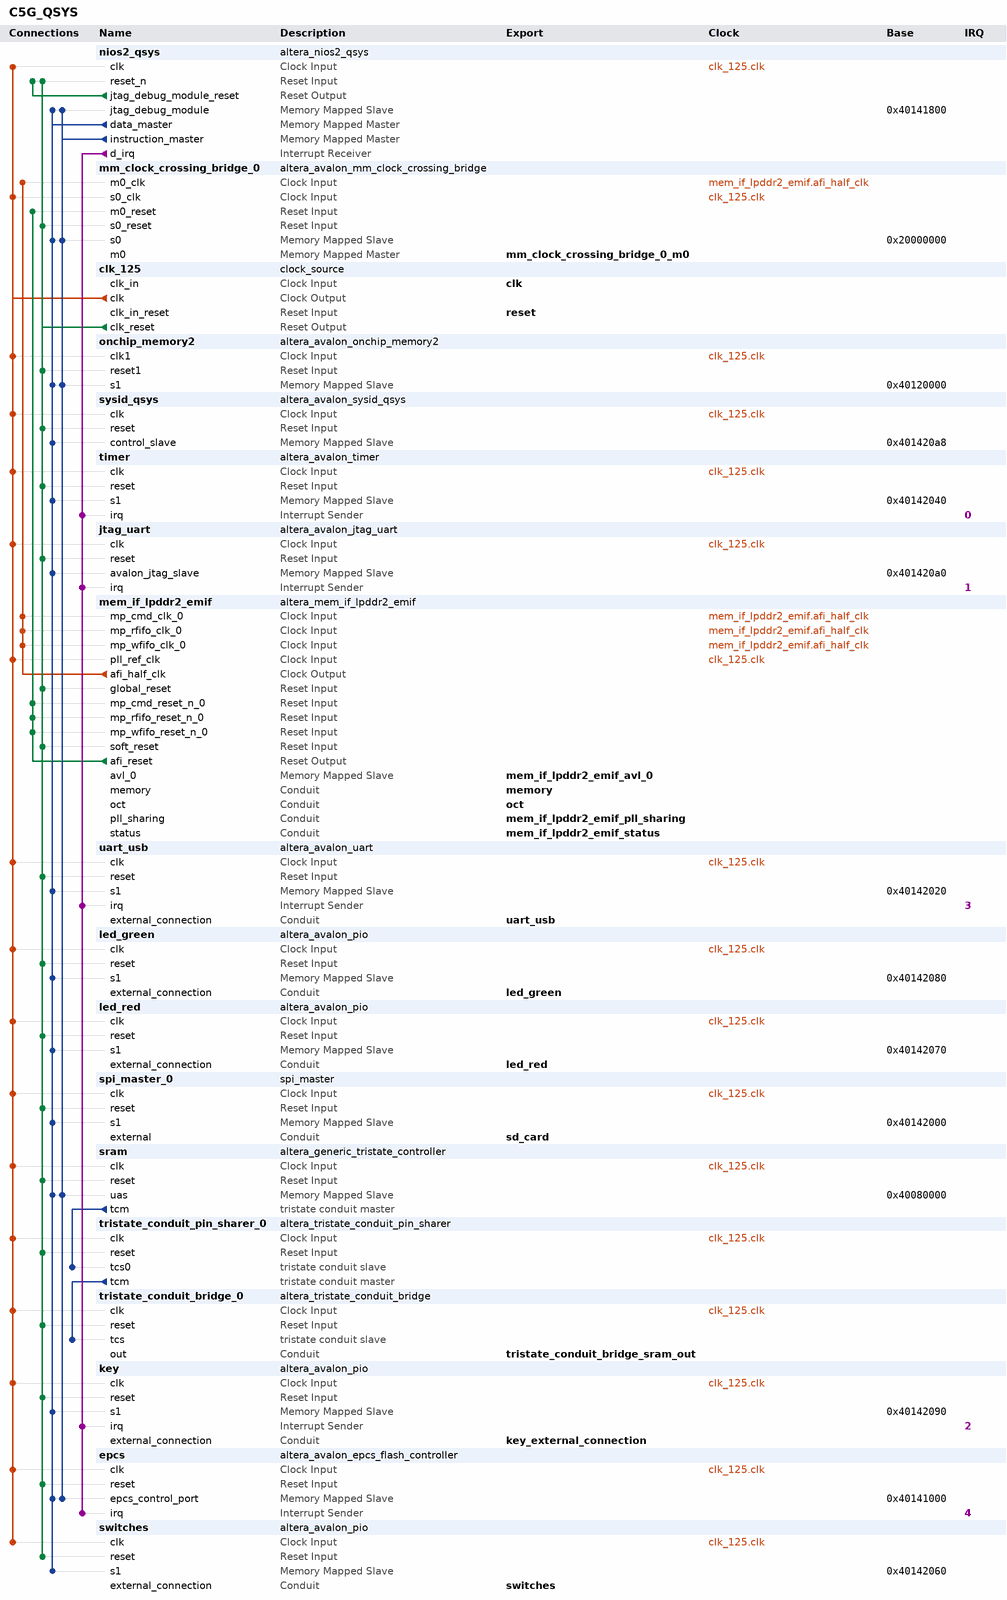
[diagram p0: system contents]
# Platform Designer (Qsys) system C5G_QSYS, Cyclone V 5CGXFC5C6F27C7
# Parameters at their usual value, and those the tool derives, are not listed.
package require -exact qsys 13.1
create_system C5G_QSYS
set_project_property DEVICE_FAMILY {Cyclone V}
set_project_property DEVICE 5CGXFC5C6F27C7

add_instance nios2_qsys altera_nios2_qsys 13.1
set_instance_parameter_value nios2_qsys muldiv_divider true
set_instance_parameter_value nios2_qsys resetSlave epcs.epcs_control_port
set_instance_parameter_value nios2_qsys mmu_TLBMissExcSlave None
set_instance_parameter_value nios2_qsys exceptionSlave sram.uas
set_instance_parameter_value nios2_qsys breakSlave nios2_qsys.jtag_debug_module
set_instance_parameter_value nios2_qsys impl Fast
set_instance_parameter_value nios2_qsys icache_size 4096

add_instance mm_clock_crossing_bridge_0 altera_avalon_mm_clock_crossing_bridge 13.1
set_instance_parameter_value mm_clock_crossing_bridge_0 DATA_WIDTH 32
set_instance_parameter_value mm_clock_crossing_bridge_0 ADDRESS_WIDTH 29
set_instance_parameter_value mm_clock_crossing_bridge_0 MAX_BURST_SIZE 8
set_instance_parameter_value mm_clock_crossing_bridge_0 COMMAND_FIFO_DEPTH 32
set_instance_parameter_value mm_clock_crossing_bridge_0 RESPONSE_FIFO_DEPTH 32
set_instance_parameter_value mm_clock_crossing_bridge_0 MASTER_SYNC_DEPTH 2
set_instance_parameter_value mm_clock_crossing_bridge_0 SLAVE_SYNC_DEPTH 2

add_instance clk_125 clock_source 13.1
set_instance_parameter_value clk_125 clockFrequency 125000000

add_instance onchip_memory2 altera_avalon_onchip_memory2 13.1
set_instance_parameter_value onchip_memory2 dataWidth 32
set_instance_parameter_value onchip_memory2 dualPort false
set_instance_parameter_value onchip_memory2 initMemContent true
set_instance_parameter_value onchip_memory2 initializationFileName onchip_mem.hex
set_instance_parameter_value onchip_memory2 memorySize 128000

add_instance sysid_qsys altera_avalon_sysid_qsys 13.1
set_instance_parameter_value sysid_qsys id 0

add_instance timer altera_avalon_timer 13.1
set_instance_parameter_value timer period 1
set_instance_parameter_value timer periodUnits MSEC

add_instance jtag_uart altera_avalon_jtag_uart 13.1
set_instance_parameter_value jtag_uart simInteractiveOptions NO_INTERACTIVE_WINDOWS

add_instance mem_if_lpddr2_emif altera_mem_if_lpddr2_emif 13.1
set_instance_parameter_value mem_if_lpddr2_emif MEM_VENDOR Micron
set_instance_parameter_value mem_if_lpddr2_emif MEM_FORMAT DISCRETE
set_instance_parameter_value mem_if_lpddr2_emif DISCRETE_FLY_BY true
set_instance_parameter_value mem_if_lpddr2_emif DEVICE_DEPTH 1
set_instance_parameter_value mem_if_lpddr2_emif MEM_MIRROR_ADDRESSING 0
set_instance_parameter_value mem_if_lpddr2_emif MEM_CLK_FREQ_MAX 400.0
set_instance_parameter_value mem_if_lpddr2_emif MEM_ROW_ADDR_WIDTH 14
set_instance_parameter_value mem_if_lpddr2_emif MEM_COL_ADDR_WIDTH 10
set_instance_parameter_value mem_if_lpddr2_emif MEM_DQ_WIDTH 32
set_instance_parameter_value mem_if_lpddr2_emif MEM_DQ_PER_DQS 8
set_instance_parameter_value mem_if_lpddr2_emif MEM_BANKADDR_WIDTH 3
set_instance_parameter_value mem_if_lpddr2_emif MEM_IF_DM_PINS_EN true
set_instance_parameter_value mem_if_lpddr2_emif MEM_IF_DQSN_EN true
set_instance_parameter_value mem_if_lpddr2_emif MEM_NUMBER_OF_DIMMS 1
set_instance_parameter_value mem_if_lpddr2_emif MEM_NUMBER_OF_RANKS_PER_DIMM 1
set_instance_parameter_value mem_if_lpddr2_emif MEM_NUMBER_OF_RANKS_PER_DEVICE 1
set_instance_parameter_value mem_if_lpddr2_emif MEM_RANK_MULTIPLICATION_FACTOR 1
set_instance_parameter_value mem_if_lpddr2_emif MEM_CK_WIDTH 1
set_instance_parameter_value mem_if_lpddr2_emif MEM_CS_WIDTH 1
set_instance_parameter_value mem_if_lpddr2_emif MEM_CLK_EN_WIDTH 1
set_instance_parameter_value mem_if_lpddr2_emif ALTMEMPHY_COMPATIBLE_MODE false
set_instance_parameter_value mem_if_lpddr2_emif NEXTGEN true
set_instance_parameter_value mem_if_lpddr2_emif MEM_IF_BOARD_BASE_DELAY 10
set_instance_parameter_value mem_if_lpddr2_emif MEM_IF_SIM_VALID_WINDOW 0
set_instance_parameter_value mem_if_lpddr2_emif MEM_GUARANTEED_WRITE_INIT false
set_instance_parameter_value mem_if_lpddr2_emif MEM_VERBOSE true
set_instance_parameter_value mem_if_lpddr2_emif PINGPONGPHY_EN false
set_instance_parameter_value mem_if_lpddr2_emif REFRESH_BURST_VALIDATION false
set_instance_parameter_value mem_if_lpddr2_emif MEM_BL 4
set_instance_parameter_value mem_if_lpddr2_emif MEM_BT Sequential
set_instance_parameter_value mem_if_lpddr2_emif MEM_DRV_STR 40
set_instance_parameter_value mem_if_lpddr2_emif MEM_DLL_EN true
set_instance_parameter_value mem_if_lpddr2_emif MEM_ATCL 0
set_instance_parameter_value mem_if_lpddr2_emif MEM_TCL 7
set_instance_parameter_value mem_if_lpddr2_emif MEM_AUTO_LEVELING_MODE true
set_instance_parameter_value mem_if_lpddr2_emif MEM_USER_LEVELING_MODE Leveling
set_instance_parameter_value mem_if_lpddr2_emif MEM_INIT_EN false
set_instance_parameter_value mem_if_lpddr2_emif DAT_DATA_WIDTH 32
set_instance_parameter_value mem_if_lpddr2_emif TIMING_TIS 175
set_instance_parameter_value mem_if_lpddr2_emif TIMING_TIH 250
set_instance_parameter_value mem_if_lpddr2_emif TIMING_TDS 50
set_instance_parameter_value mem_if_lpddr2_emif TIMING_TDH 125
set_instance_parameter_value mem_if_lpddr2_emif TIMING_TDQSQ 120
set_instance_parameter_value mem_if_lpddr2_emif TIMING_TQHS 300
set_instance_parameter_value mem_if_lpddr2_emif TIMING_TDQSCK 2500
set_instance_parameter_value mem_if_lpddr2_emif TIMING_TDQSCKDS 450
set_instance_parameter_value mem_if_lpddr2_emif TIMING_TDQSCKDM 900
set_instance_parameter_value mem_if_lpddr2_emif TIMING_TDQSCKDL 1200
set_instance_parameter_value mem_if_lpddr2_emif TIMING_TDQSS 0.25
set_instance_parameter_value mem_if_lpddr2_emif TIMING_TDQSH 0.35
set_instance_parameter_value mem_if_lpddr2_emif TIMING_TDSH 0.2
set_instance_parameter_value mem_if_lpddr2_emif TIMING_TDSS 0.2
set_instance_parameter_value mem_if_lpddr2_emif MEM_TINIT_US 500
set_instance_parameter_value mem_if_lpddr2_emif MEM_TMRD_CK 3
set_instance_parameter_value mem_if_lpddr2_emif MEM_TRAS_NS 42.0
set_instance_parameter_value mem_if_lpddr2_emif MEM_TRCD_NS 15.0
set_instance_parameter_value mem_if_lpddr2_emif MEM_TRP_NS 18.0
set_instance_parameter_value mem_if_lpddr2_emif MEM_TREFI_US 15.6
set_instance_parameter_value mem_if_lpddr2_emif MEM_TRFC_NS 75.0
set_instance_parameter_value mem_if_lpddr2_emif CFG_TCCD_NS 2.5
set_instance_parameter_value mem_if_lpddr2_emif MEM_TWR_NS 15.0
set_instance_parameter_value mem_if_lpddr2_emif MEM_TWTR 2
set_instance_parameter_value mem_if_lpddr2_emif MEM_TFAW_NS 60.0
set_instance_parameter_value mem_if_lpddr2_emif MEM_TRRD_NS 10.0
set_instance_parameter_value mem_if_lpddr2_emif MEM_TRTP_NS 10.0
set_instance_parameter_value mem_if_lpddr2_emif RATE Full
set_instance_parameter_value mem_if_lpddr2_emif MEM_CLK_FREQ 330.0
set_instance_parameter_value mem_if_lpddr2_emif USE_MEM_CLK_FREQ false
set_instance_parameter_value mem_if_lpddr2_emif FORCE_DQS_TRACKING AUTO
set_instance_parameter_value mem_if_lpddr2_emif FORCE_SHADOW_REGS AUTO
set_instance_parameter_value mem_if_lpddr2_emif MRS_MIRROR_PING_PONG_ATSO false
set_instance_parameter_value mem_if_lpddr2_emif PARSE_FRIENDLY_DEVICE_FAMILY_PARAM_VALID false
set_instance_parameter_value mem_if_lpddr2_emif SPEED_GRADE 7
set_instance_parameter_value mem_if_lpddr2_emif IS_ES_DEVICE false
set_instance_parameter_value mem_if_lpddr2_emif DISABLE_CHILD_MESSAGING false
set_instance_parameter_value mem_if_lpddr2_emif HARD_EMIF true
set_instance_parameter_value mem_if_lpddr2_emif HHP_HPS false
set_instance_parameter_value mem_if_lpddr2_emif HHP_HPS_VERIFICATION false
set_instance_parameter_value mem_if_lpddr2_emif HHP_HPS_SIMULATION false
set_instance_parameter_value mem_if_lpddr2_emif HPS_PROTOCOL DEFAULT
set_instance_parameter_value mem_if_lpddr2_emif CUT_NEW_FAMILY_TIMING true
set_instance_parameter_value mem_if_lpddr2_emif POWER_OF_TWO_BUS true
set_instance_parameter_value mem_if_lpddr2_emif SOPC_COMPAT_RESET false
set_instance_parameter_value mem_if_lpddr2_emif AVL_MAX_SIZE 4
set_instance_parameter_value mem_if_lpddr2_emif BYTE_ENABLE true
set_instance_parameter_value mem_if_lpddr2_emif ENABLE_CTRL_AVALON_INTERFACE true
set_instance_parameter_value mem_if_lpddr2_emif CTL_DEEP_POWERDN_EN false
set_instance_parameter_value mem_if_lpddr2_emif CTL_SELF_REFRESH_EN false
set_instance_parameter_value mem_if_lpddr2_emif CTL_USR_REFRESH_EN false
set_instance_parameter_value mem_if_lpddr2_emif CTL_AUTOPCH_EN false
set_instance_parameter_value mem_if_lpddr2_emif CTL_ZQCAL_EN false
set_instance_parameter_value mem_if_lpddr2_emif ADDR_ORDER 0
set_instance_parameter_value mem_if_lpddr2_emif CTL_LOOK_AHEAD_DEPTH 4
set_instance_parameter_value mem_if_lpddr2_emif CONTROLLER_LATENCY 5
set_instance_parameter_value mem_if_lpddr2_emif CFG_REORDER_DATA true
set_instance_parameter_value mem_if_lpddr2_emif STARVE_LIMIT 10
set_instance_parameter_value mem_if_lpddr2_emif CTL_CSR_ENABLED false
set_instance_parameter_value mem_if_lpddr2_emif CTL_CSR_CONNECTION INTERNAL_JTAG
set_instance_parameter_value mem_if_lpddr2_emif CTL_ECC_ENABLED false
set_instance_parameter_value mem_if_lpddr2_emif CTL_HRB_ENABLED false
set_instance_parameter_value mem_if_lpddr2_emif CTL_ECC_AUTO_CORRECTION_ENABLED false
set_instance_parameter_value mem_if_lpddr2_emif MULTICAST_EN false
set_instance_parameter_value mem_if_lpddr2_emif CTL_DYNAMIC_BANK_ALLOCATION false
set_instance_parameter_value mem_if_lpddr2_emif CTL_DYNAMIC_BANK_NUM 4
set_instance_parameter_value mem_if_lpddr2_emif DEBUG_MODE false
set_instance_parameter_value mem_if_lpddr2_emif ENABLE_BURST_MERGE false
set_instance_parameter_value mem_if_lpddr2_emif CTL_ENABLE_BURST_INTERRUPT false
set_instance_parameter_value mem_if_lpddr2_emif CTL_ENABLE_BURST_TERMINATE false
set_instance_parameter_value mem_if_lpddr2_emif LOCAL_ID_WIDTH 8
set_instance_parameter_value mem_if_lpddr2_emif WRBUFFER_ADDR_WIDTH 6
set_instance_parameter_value mem_if_lpddr2_emif MAX_PENDING_WR_CMD 8
set_instance_parameter_value mem_if_lpddr2_emif MAX_PENDING_RD_CMD 16
set_instance_parameter_value mem_if_lpddr2_emif USE_MM_ADAPTOR true
set_instance_parameter_value mem_if_lpddr2_emif USE_AXI_ADAPTOR false
set_instance_parameter_value mem_if_lpddr2_emif HCX_COMPAT_MODE false
set_instance_parameter_value mem_if_lpddr2_emif CTL_CMD_QUEUE_DEPTH 8
set_instance_parameter_value mem_if_lpddr2_emif CTL_CSR_READ_ONLY 1
set_instance_parameter_value mem_if_lpddr2_emif CFG_DATA_REORDERING_TYPE INTER_BANK
set_instance_parameter_value mem_if_lpddr2_emif NUM_OF_PORTS 1
set_instance_parameter_value mem_if_lpddr2_emif ENABLE_BONDING false
set_instance_parameter_value mem_if_lpddr2_emif ENABLE_USER_ECC false
set_instance_parameter_value mem_if_lpddr2_emif AVL_DATA_WIDTH_PORT 32,32,32,32,32,32
set_instance_parameter_value mem_if_lpddr2_emif PRIORITY_PORT 1,1,1,1,1,1
set_instance_parameter_value mem_if_lpddr2_emif WEIGHT_PORT 0,0,0,0,0,0
set_instance_parameter_value mem_if_lpddr2_emif CPORT_TYPE_PORT Bidirectional,Bidirectional,Bidirectional,Bidirectional,Bidirectional,Bidirectional
set_instance_parameter_value mem_if_lpddr2_emif ENABLE_EMIT_BFM_MASTER false
set_instance_parameter_value mem_if_lpddr2_emif FORCE_SEQUENCER_TCL_DEBUG_MODE false
set_instance_parameter_value mem_if_lpddr2_emif ENABLE_SEQUENCER_MARGINING_ON_BY_DEFAULT false
set_instance_parameter_value mem_if_lpddr2_emif REF_CLK_FREQ 125.0
set_instance_parameter_value mem_if_lpddr2_emif REF_CLK_FREQ_PARAM_VALID false
set_instance_parameter_value mem_if_lpddr2_emif REF_CLK_FREQ_MIN_PARAM 0.0
set_instance_parameter_value mem_if_lpddr2_emif REF_CLK_FREQ_MAX_PARAM 0.0
set_instance_parameter_value mem_if_lpddr2_emif PLL_DR_CLK_FREQ_PARAM 0.0
set_instance_parameter_value mem_if_lpddr2_emif PLL_DR_CLK_PHASE_PS_PARAM 0
set_instance_parameter_value mem_if_lpddr2_emif PLL_DR_CLK_MULT_PARAM 0
set_instance_parameter_value mem_if_lpddr2_emif PLL_DR_CLK_DIV_PARAM 0
set_instance_parameter_value mem_if_lpddr2_emif PLL_MEM_CLK_FREQ_PARAM 0.0
set_instance_parameter_value mem_if_lpddr2_emif PLL_MEM_CLK_PHASE_PS_PARAM 0
set_instance_parameter_value mem_if_lpddr2_emif PLL_MEM_CLK_MULT_PARAM 0
set_instance_parameter_value mem_if_lpddr2_emif PLL_MEM_CLK_DIV_PARAM 0
set_instance_parameter_value mem_if_lpddr2_emif PLL_AFI_CLK_FREQ_PARAM 0.0
set_instance_parameter_value mem_if_lpddr2_emif PLL_AFI_CLK_PHASE_PS_PARAM 0
set_instance_parameter_value mem_if_lpddr2_emif PLL_AFI_CLK_MULT_PARAM 0
set_instance_parameter_value mem_if_lpddr2_emif PLL_AFI_CLK_DIV_PARAM 0
set_instance_parameter_value mem_if_lpddr2_emif PLL_WRITE_CLK_FREQ_PARAM 0.0
set_instance_parameter_value mem_if_lpddr2_emif PLL_WRITE_CLK_PHASE_PS_PARAM 0
set_instance_parameter_value mem_if_lpddr2_emif PLL_WRITE_CLK_MULT_PARAM 0
set_instance_parameter_value mem_if_lpddr2_emif PLL_WRITE_CLK_DIV_PARAM 0
set_instance_parameter_value mem_if_lpddr2_emif PLL_ADDR_CMD_CLK_FREQ_PARAM 0.0
set_instance_parameter_value mem_if_lpddr2_emif PLL_ADDR_CMD_CLK_PHASE_PS_PARAM 0
set_instance_parameter_value mem_if_lpddr2_emif PLL_ADDR_CMD_CLK_MULT_PARAM 0
set_instance_parameter_value mem_if_lpddr2_emif PLL_ADDR_CMD_CLK_DIV_PARAM 0
set_instance_parameter_value mem_if_lpddr2_emif PLL_AFI_HALF_CLK_FREQ_PARAM 0.0
set_instance_parameter_value mem_if_lpddr2_emif PLL_AFI_HALF_CLK_PHASE_PS_PARAM 0
set_instance_parameter_value mem_if_lpddr2_emif PLL_AFI_HALF_CLK_MULT_PARAM 0
set_instance_parameter_value mem_if_lpddr2_emif PLL_AFI_HALF_CLK_DIV_PARAM 0
set_instance_parameter_value mem_if_lpddr2_emif PLL_NIOS_CLK_FREQ_PARAM 0.0
set_instance_parameter_value mem_if_lpddr2_emif PLL_NIOS_CLK_PHASE_PS_PARAM 0
set_instance_parameter_value mem_if_lpddr2_emif PLL_NIOS_CLK_MULT_PARAM 0
set_instance_parameter_value mem_if_lpddr2_emif PLL_NIOS_CLK_DIV_PARAM 0
set_instance_parameter_value mem_if_lpddr2_emif PLL_CONFIG_CLK_FREQ_PARAM 0.0
set_instance_parameter_value mem_if_lpddr2_emif PLL_CONFIG_CLK_PHASE_PS_PARAM 0
set_instance_parameter_value mem_if_lpddr2_emif PLL_CONFIG_CLK_MULT_PARAM 0
set_instance_parameter_value mem_if_lpddr2_emif PLL_CONFIG_CLK_DIV_PARAM 0
set_instance_parameter_value mem_if_lpddr2_emif PLL_P2C_READ_CLK_FREQ_PARAM 0.0
set_instance_parameter_value mem_if_lpddr2_emif PLL_P2C_READ_CLK_PHASE_PS_PARAM 0
set_instance_parameter_value mem_if_lpddr2_emif PLL_P2C_READ_CLK_MULT_PARAM 0
set_instance_parameter_value mem_if_lpddr2_emif PLL_P2C_READ_CLK_DIV_PARAM 0
set_instance_parameter_value mem_if_lpddr2_emif PLL_C2P_WRITE_CLK_FREQ_PARAM 0.0
set_instance_parameter_value mem_if_lpddr2_emif PLL_C2P_WRITE_CLK_PHASE_PS_PARAM 0
set_instance_parameter_value mem_if_lpddr2_emif PLL_C2P_WRITE_CLK_MULT_PARAM 0
set_instance_parameter_value mem_if_lpddr2_emif PLL_C2P_WRITE_CLK_DIV_PARAM 0
set_instance_parameter_value mem_if_lpddr2_emif PLL_HR_CLK_FREQ_PARAM 0.0
set_instance_parameter_value mem_if_lpddr2_emif PLL_HR_CLK_PHASE_PS_PARAM 0
set_instance_parameter_value mem_if_lpddr2_emif PLL_HR_CLK_MULT_PARAM 0
set_instance_parameter_value mem_if_lpddr2_emif PLL_HR_CLK_DIV_PARAM 0
set_instance_parameter_value mem_if_lpddr2_emif PLL_AFI_PHY_CLK_FREQ_PARAM 0.0
set_instance_parameter_value mem_if_lpddr2_emif PLL_AFI_PHY_CLK_PHASE_PS_PARAM 0
set_instance_parameter_value mem_if_lpddr2_emif PLL_AFI_PHY_CLK_MULT_PARAM 0
set_instance_parameter_value mem_if_lpddr2_emif PLL_AFI_PHY_CLK_DIV_PARAM 0
set_instance_parameter_value mem_if_lpddr2_emif PLL_CLK_PARAM_VALID false
set_instance_parameter_value mem_if_lpddr2_emif ENABLE_EXTRA_REPORTING false
set_instance_parameter_value mem_if_lpddr2_emif NUM_EXTRA_REPORT_PATH 10
set_instance_parameter_value mem_if_lpddr2_emif ENABLE_ISS_PROBES false
set_instance_parameter_value mem_if_lpddr2_emif CALIB_REG_WIDTH 8
set_instance_parameter_value mem_if_lpddr2_emif USE_SEQUENCER_BFM false
set_instance_parameter_value mem_if_lpddr2_emif DEFAULT_FAST_SIM_MODEL true
set_instance_parameter_value mem_if_lpddr2_emif PLL_SHARING_MODE None
set_instance_parameter_value mem_if_lpddr2_emif NUM_PLL_SHARING_INTERFACES 1
set_instance_parameter_value mem_if_lpddr2_emif EXPORT_AFI_HALF_CLK true
set_instance_parameter_value mem_if_lpddr2_emif ABSTRACT_REAL_COMPARE_TEST false
set_instance_parameter_value mem_if_lpddr2_emif INCLUDE_BOARD_DELAY_MODEL false
set_instance_parameter_value mem_if_lpddr2_emif INCLUDE_MULTIRANK_BOARD_DELAY_MODEL false
set_instance_parameter_value mem_if_lpddr2_emif USE_FAKE_PHY false
set_instance_parameter_value mem_if_lpddr2_emif FORCE_MAX_LATENCY_COUNT_WIDTH 0
set_instance_parameter_value mem_if_lpddr2_emif ENABLE_NON_DESTRUCTIVE_CALIB false
set_instance_parameter_value mem_if_lpddr2_emif TRACKING_ERROR_TEST false
set_instance_parameter_value mem_if_lpddr2_emif TRACKING_WATCH_TEST false
set_instance_parameter_value mem_if_lpddr2_emif MARGIN_VARIATION_TEST false
set_instance_parameter_value mem_if_lpddr2_emif MEM_DEVICE MISSING_MODEL
set_instance_parameter_value mem_if_lpddr2_emif FORCED_NUM_WRITE_FR_CYCLE_SHIFTS 0
set_instance_parameter_value mem_if_lpddr2_emif SEQUENCER_TYPE NIOS
set_instance_parameter_value mem_if_lpddr2_emif ADVERTIZE_SEQUENCER_SW_BUILD_FILES false
set_instance_parameter_value mem_if_lpddr2_emif FORCED_NON_LDC_ADDR_CMD_MEM_CK_INVERT false
set_instance_parameter_value mem_if_lpddr2_emif PHY_ONLY false
set_instance_parameter_value mem_if_lpddr2_emif SEQ_MODE 0
set_instance_parameter_value mem_if_lpddr2_emif ADVANCED_CK_PHASES false
set_instance_parameter_value mem_if_lpddr2_emif COMMAND_PHASE 0.0
set_instance_parameter_value mem_if_lpddr2_emif MEM_CK_PHASE 0.0
set_instance_parameter_value mem_if_lpddr2_emif P2C_READ_CLOCK_ADD_PHASE 0.0
set_instance_parameter_value mem_if_lpddr2_emif C2P_WRITE_CLOCK_ADD_PHASE 0.0
set_instance_parameter_value mem_if_lpddr2_emif ACV_PHY_CLK_ADD_FR_PHASE 0.0
set_instance_parameter_value mem_if_lpddr2_emif PLL_LOCATION Top_Bottom
set_instance_parameter_value mem_if_lpddr2_emif SKIP_MEM_INIT true
set_instance_parameter_value mem_if_lpddr2_emif READ_DQ_DQS_CLOCK_SOURCE INVERTED_DQS_BUS
set_instance_parameter_value mem_if_lpddr2_emif DQ_INPUT_REG_USE_CLKN false
set_instance_parameter_value mem_if_lpddr2_emif DQS_DQSN_MODE DIFFERENTIAL
set_instance_parameter_value mem_if_lpddr2_emif AFI_DEBUG_INFO_WIDTH 32
set_instance_parameter_value mem_if_lpddr2_emif CALIBRATION_MODE Full
set_instance_parameter_value mem_if_lpddr2_emif NIOS_ROM_DATA_WIDTH 32
set_instance_parameter_value mem_if_lpddr2_emif READ_FIFO_SIZE 8
set_instance_parameter_value mem_if_lpddr2_emif PHY_CSR_ENABLED false
set_instance_parameter_value mem_if_lpddr2_emif PHY_CSR_CONNECTION INTERNAL_JTAG
set_instance_parameter_value mem_if_lpddr2_emif USER_DEBUG_LEVEL 0
set_instance_parameter_value mem_if_lpddr2_emif TIMING_BOARD_DERATE_METHOD AUTO
set_instance_parameter_value mem_if_lpddr2_emif TIMING_BOARD_CK_CKN_SLEW_RATE 2.0
set_instance_parameter_value mem_if_lpddr2_emif TIMING_BOARD_AC_SLEW_RATE 1.0
set_instance_parameter_value mem_if_lpddr2_emif TIMING_BOARD_DQS_DQSN_SLEW_RATE 2.0
set_instance_parameter_value mem_if_lpddr2_emif TIMING_BOARD_DQ_SLEW_RATE 1.0
set_instance_parameter_value mem_if_lpddr2_emif TIMING_BOARD_TIS 0.0
set_instance_parameter_value mem_if_lpddr2_emif TIMING_BOARD_TIH 0.0
set_instance_parameter_value mem_if_lpddr2_emif TIMING_BOARD_TDS 0.0
set_instance_parameter_value mem_if_lpddr2_emif TIMING_BOARD_TDH 0.0
set_instance_parameter_value mem_if_lpddr2_emif TIMING_BOARD_ISI_METHOD AUTO
set_instance_parameter_value mem_if_lpddr2_emif TIMING_BOARD_AC_EYE_REDUCTION_SU 0.0
set_instance_parameter_value mem_if_lpddr2_emif TIMING_BOARD_AC_EYE_REDUCTION_H 0.0
set_instance_parameter_value mem_if_lpddr2_emif TIMING_BOARD_DQ_EYE_REDUCTION 0.0
set_instance_parameter_value mem_if_lpddr2_emif TIMING_BOARD_DELTA_DQS_ARRIVAL_TIME 0.0
set_instance_parameter_value mem_if_lpddr2_emif TIMING_BOARD_READ_DQ_EYE_REDUCTION 0.0
set_instance_parameter_value mem_if_lpddr2_emif TIMING_BOARD_DELTA_READ_DQS_ARRIVAL_TIME 0.0
set_instance_parameter_value mem_if_lpddr2_emif PACKAGE_DESKEW false
set_instance_parameter_value mem_if_lpddr2_emif AC_PACKAGE_DESKEW false
set_instance_parameter_value mem_if_lpddr2_emif TIMING_BOARD_MAX_CK_DELAY 0.33
set_instance_parameter_value mem_if_lpddr2_emif TIMING_BOARD_MAX_DQS_DELAY 0.34
set_instance_parameter_value mem_if_lpddr2_emif TIMING_BOARD_SKEW_CKDQS_DIMM_MIN -0.01
set_instance_parameter_value mem_if_lpddr2_emif TIMING_BOARD_SKEW_CKDQS_DIMM_MAX 0.01
set_instance_parameter_value mem_if_lpddr2_emif TIMING_BOARD_SKEW_BETWEEN_DIMMS 0.05
set_instance_parameter_value mem_if_lpddr2_emif TIMING_BOARD_SKEW_WITHIN_DQS 0.02
set_instance_parameter_value mem_if_lpddr2_emif TIMING_BOARD_SKEW_BETWEEN_DQS 0.02
set_instance_parameter_value mem_if_lpddr2_emif TIMING_BOARD_DQ_TO_DQS_SKEW 0.0
set_instance_parameter_value mem_if_lpddr2_emif TIMING_BOARD_AC_SKEW 0.02
set_instance_parameter_value mem_if_lpddr2_emif TIMING_BOARD_AC_TO_CK_SKEW 0.0
set_instance_parameter_value mem_if_lpddr2_emif ENABLE_EXPORT_SEQ_DEBUG_BRIDGE false
set_instance_parameter_value mem_if_lpddr2_emif CORE_DEBUG_CONNECTION EXPORT
set_instance_parameter_value mem_if_lpddr2_emif ADD_EXTERNAL_SEQ_DEBUG_NIOS false
set_instance_parameter_value mem_if_lpddr2_emif ED_EXPORT_SEQ_DEBUG false
set_instance_parameter_value mem_if_lpddr2_emif ADD_EFFICIENCY_MONITOR false
set_instance_parameter_value mem_if_lpddr2_emif ENABLE_ABS_RAM_MEM_INIT false
set_instance_parameter_value mem_if_lpddr2_emif ABS_RAM_MEM_INIT_FILENAME meminit
set_instance_parameter_value mem_if_lpddr2_emif DLL_SHARING_MODE None
set_instance_parameter_value mem_if_lpddr2_emif NUM_DLL_SHARING_INTERFACES 1
set_instance_parameter_value mem_if_lpddr2_emif OCT_SHARING_MODE None
set_instance_parameter_value mem_if_lpddr2_emif NUM_OCT_SHARING_INTERFACES 1

add_instance uart_usb altera_avalon_uart 13.1
set_instance_parameter_value uart_usb baud 115200
set_instance_parameter_value uart_usb dataBits 8
set_instance_parameter_value uart_usb fixedBaud false
set_instance_parameter_value uart_usb parity NONE
set_instance_parameter_value uart_usb stopBits 1

add_instance led_green altera_avalon_pio 13.1
set_instance_parameter_value led_green direction Output
set_instance_parameter_value led_green width 8

add_instance led_red altera_avalon_pio 13.1
set_instance_parameter_value led_red direction Output
set_instance_parameter_value led_red width 10

add_instance spi_master_0 spi_master 1.3

add_instance sram altera_generic_tristate_controller 13.1
set_instance_parameter_value sram TCM_ADDRESS_W 19
set_instance_parameter_value sram TCM_DATA_W 16
set_instance_parameter_value sram TCM_BYTEENABLE_W 2
set_instance_parameter_value sram TCM_READ_WAIT 10
set_instance_parameter_value sram TCM_WRITE_WAIT 10
set_instance_parameter_value sram TCM_SETUP_WAIT 10
set_instance_parameter_value sram TCM_DATA_HOLD 10
set_instance_parameter_value sram TCM_MAX_PENDING_READ_TRANSACTIONS 3
set_instance_parameter_value sram TCM_TURNAROUND_TIME 2
set_instance_parameter_value sram TCM_TIMING_UNITS 0
set_instance_parameter_value sram TCM_READLATENCY 2
set_instance_parameter_value sram TCM_SYMBOLS_PER_WORD 2
set_instance_parameter_value sram USE_READ 0
set_instance_parameter_value sram USE_BEGINTRANSFER 0
set_instance_parameter_value sram USE_BYTEENABLE 1
set_instance_parameter_value sram USE_OUTPUTENABLE 1
set_instance_parameter_value sram ACTIVE_LOW_READ 0
set_instance_parameter_value sram ACTIVE_LOW_BYTEENABLE 1
set_instance_parameter_value sram ACTIVE_LOW_OUTPUTENABLE 1
set_instance_parameter_value sram ACTIVE_LOW_BEGINTRANSFER 0
set_instance_parameter_value sram CHIPSELECT_THROUGH_READLATENCY 0
set_instance_parameter_value sram MODULE_ASSIGNMENT_KEYS embeddedsw.configuration.hwClassnameDriverSupportList,embeddedsw.CMacro.SRAM_MEMORY_SIZE,embeddedsw.CMacro.SRAM_MEMORY_UNITS,embeddedsw.CMacro.SRAM_DATA_WIDTH,embeddedsw.memoryInfo.MEM_INIT_DATA_WIDTH,embeddedsw.memoryInfo.HAS_BYTE_LANE,embeddedsw.memoryInfo.GENERATE_DAT_SYM,embeddedsw.memoryInfo.DAT_SYM_INSTALL_DIR
set_instance_parameter_value sram MODULE_ASSIGNMENT_VALUES "altera_avalon_lan91c111\\,altera_avalon_cfi_flash,524288,1,16,16,1,1,SIM_DIR"
set_instance_parameter_value sram INTERFACE_ASSIGNMENT_KEYS embeddedsw.configuration.isMemoryDevice
set_instance_parameter_value sram INTERFACE_ASSIGNMENT_VALUES 1

add_instance tristate_conduit_pin_sharer_0 altera_tristate_conduit_pin_sharer 13.1
set_instance_parameter_value tristate_conduit_pin_sharer_0 NUM_INTERFACES 1
set_instance_parameter_value tristate_conduit_pin_sharer_0 MODULE_ORIGIN_LIST sram.tcm,sram.tcm,sram.tcm,sram.tcm,sram.tcm,sram.tcm
set_instance_parameter_value tristate_conduit_pin_sharer_0 SIGNAL_ORIGIN_LIST address,outputenable_n,byteenable_n,write_n,data,chipselect_n

add_instance tristate_conduit_bridge_0 altera_tristate_conduit_bridge 13.1

add_instance key altera_avalon_pio 13.1
set_instance_parameter_value key captureEdge true
set_instance_parameter_value key direction Input
set_instance_parameter_value key edgeType FALLING
set_instance_parameter_value key generateIRQ true
set_instance_parameter_value key irqType EDGE
set_instance_parameter_value key width 4

add_instance epcs altera_avalon_epcs_flash_controller 13.1

add_instance switches altera_avalon_pio 13.1
set_instance_parameter_value switches direction Input
set_instance_parameter_value switches width 10

# connections
add_connection clk_125.clk epcs.clk clock
add_connection clk_125.clk jtag_uart.clk clock
add_connection clk_125.clk key.clk clock
add_connection clk_125.clk led_green.clk clock
add_connection clk_125.clk led_red.clk clock
add_connection clk_125.clk mem_if_lpddr2_emif.pll_ref_clk clock
add_connection clk_125.clk mm_clock_crossing_bridge_0.s0_clk clock
add_connection clk_125.clk nios2_qsys.clk clock
add_connection clk_125.clk onchip_memory2.clk1 clock
add_connection clk_125.clk spi_master_0.clk clock
add_connection clk_125.clk sram.clk clock
add_connection clk_125.clk switches.clk clock
add_connection clk_125.clk sysid_qsys.clk clock
add_connection clk_125.clk timer.clk clock
add_connection clk_125.clk tristate_conduit_bridge_0.clk clock
add_connection clk_125.clk tristate_conduit_pin_sharer_0.clk clock
add_connection clk_125.clk uart_usb.clk clock
add_connection mem_if_lpddr2_emif.afi_half_clk mem_if_lpddr2_emif.mp_cmd_clk_0 clock
add_connection mem_if_lpddr2_emif.afi_half_clk mem_if_lpddr2_emif.mp_rfifo_clk_0 clock
add_connection mem_if_lpddr2_emif.afi_half_clk mem_if_lpddr2_emif.mp_wfifo_clk_0 clock
add_connection mem_if_lpddr2_emif.afi_half_clk mm_clock_crossing_bridge_0.m0_clk clock
add_connection clk_125.clk_reset epcs.reset reset
add_connection clk_125.clk_reset jtag_uart.reset reset
add_connection clk_125.clk_reset key.reset reset
add_connection clk_125.clk_reset led_green.reset reset
add_connection clk_125.clk_reset led_red.reset reset
add_connection clk_125.clk_reset mem_if_lpddr2_emif.global_reset reset
add_connection clk_125.clk_reset mem_if_lpddr2_emif.soft_reset reset
add_connection clk_125.clk_reset mm_clock_crossing_bridge_0.s0_reset reset
add_connection clk_125.clk_reset nios2_qsys.reset_n reset
add_connection clk_125.clk_reset onchip_memory2.reset1 reset
add_connection clk_125.clk_reset spi_master_0.reset reset
add_connection clk_125.clk_reset sram.reset reset
add_connection clk_125.clk_reset switches.reset reset
add_connection clk_125.clk_reset sysid_qsys.reset reset
add_connection clk_125.clk_reset timer.reset reset
add_connection clk_125.clk_reset tristate_conduit_bridge_0.reset reset
add_connection clk_125.clk_reset tristate_conduit_pin_sharer_0.reset reset
add_connection clk_125.clk_reset uart_usb.reset reset
add_connection mem_if_lpddr2_emif.afi_reset mem_if_lpddr2_emif.mp_cmd_reset_n_0 reset
add_connection mem_if_lpddr2_emif.afi_reset mem_if_lpddr2_emif.mp_rfifo_reset_n_0 reset
add_connection mem_if_lpddr2_emif.afi_reset mem_if_lpddr2_emif.mp_wfifo_reset_n_0 reset
add_connection mem_if_lpddr2_emif.afi_reset mm_clock_crossing_bridge_0.m0_reset reset
add_connection nios2_qsys.jtag_debug_module_reset nios2_qsys.reset_n reset
add_connection nios2_qsys.data_master epcs.epcs_control_port avalon
set_connection_parameter_value nios2_qsys.data_master/epcs.epcs_control_port baseAddress 0x40141000
add_connection nios2_qsys.data_master jtag_uart.avalon_jtag_slave avalon
set_connection_parameter_value nios2_qsys.data_master/jtag_uart.avalon_jtag_slave baseAddress 0x401420a0
add_connection nios2_qsys.data_master key.s1 avalon
set_connection_parameter_value nios2_qsys.data_master/key.s1 baseAddress 0x40142090
add_connection nios2_qsys.data_master led_green.s1 avalon
set_connection_parameter_value nios2_qsys.data_master/led_green.s1 baseAddress 0x40142080
add_connection nios2_qsys.data_master led_red.s1 avalon
set_connection_parameter_value nios2_qsys.data_master/led_red.s1 baseAddress 0x40142070
add_connection nios2_qsys.data_master mm_clock_crossing_bridge_0.s0 avalon
set_connection_parameter_value nios2_qsys.data_master/mm_clock_crossing_bridge_0.s0 baseAddress 0x20000000
add_connection nios2_qsys.data_master nios2_qsys.jtag_debug_module avalon
set_connection_parameter_value nios2_qsys.data_master/nios2_qsys.jtag_debug_module baseAddress 0x40141800
add_connection nios2_qsys.data_master onchip_memory2.s1 avalon
set_connection_parameter_value nios2_qsys.data_master/onchip_memory2.s1 baseAddress 0x40120000
add_connection nios2_qsys.data_master spi_master_0.s1 avalon
set_connection_parameter_value nios2_qsys.data_master/spi_master_0.s1 baseAddress 0x40142000
add_connection nios2_qsys.data_master sram.uas avalon
set_connection_parameter_value nios2_qsys.data_master/sram.uas baseAddress 0x40080000
add_connection nios2_qsys.data_master switches.s1 avalon
set_connection_parameter_value nios2_qsys.data_master/switches.s1 baseAddress 0x40142060
add_connection nios2_qsys.data_master sysid_qsys.control_slave avalon
set_connection_parameter_value nios2_qsys.data_master/sysid_qsys.control_slave baseAddress 0x401420a8
add_connection nios2_qsys.data_master timer.s1 avalon
set_connection_parameter_value nios2_qsys.data_master/timer.s1 baseAddress 0x40142040
add_connection nios2_qsys.data_master uart_usb.s1 avalon
set_connection_parameter_value nios2_qsys.data_master/uart_usb.s1 baseAddress 0x40142020
add_connection nios2_qsys.instruction_master epcs.epcs_control_port avalon
set_connection_parameter_value nios2_qsys.instruction_master/epcs.epcs_control_port baseAddress 0x40141000
add_connection nios2_qsys.instruction_master mm_clock_crossing_bridge_0.s0 avalon
set_connection_parameter_value nios2_qsys.instruction_master/mm_clock_crossing_bridge_0.s0 baseAddress 0x20000000
add_connection nios2_qsys.instruction_master nios2_qsys.jtag_debug_module avalon
set_connection_parameter_value nios2_qsys.instruction_master/nios2_qsys.jtag_debug_module baseAddress 0x40141800
add_connection nios2_qsys.instruction_master onchip_memory2.s1 avalon
set_connection_parameter_value nios2_qsys.instruction_master/onchip_memory2.s1 baseAddress 0x40120000
add_connection nios2_qsys.instruction_master sram.uas avalon
set_connection_parameter_value nios2_qsys.instruction_master/sram.uas baseAddress 0x40080000
add_connection nios2_qsys.d_irq epcs.irq interrupt
set_connection_parameter_value nios2_qsys.d_irq/epcs.irq irqNumber 4
add_connection nios2_qsys.d_irq jtag_uart.irq interrupt
set_connection_parameter_value nios2_qsys.d_irq/jtag_uart.irq irqNumber 1
add_connection nios2_qsys.d_irq key.irq interrupt
set_connection_parameter_value nios2_qsys.d_irq/key.irq irqNumber 2
add_connection nios2_qsys.d_irq timer.irq interrupt
set_connection_parameter_value nios2_qsys.d_irq/timer.irq irqNumber 0
add_connection nios2_qsys.d_irq uart_usb.irq interrupt
set_connection_parameter_value nios2_qsys.d_irq/uart_usb.irq irqNumber 3
add_connection sram.tcm tristate_conduit_pin_sharer_0.tcs0 tristate_conduit
add_connection tristate_conduit_pin_sharer_0.tcm tristate_conduit_bridge_0.tcs tristate_conduit

# exported interfaces
add_interface clk clock sink
set_interface_property clk EXPORT_OF clk_125.clk_in
add_interface reset reset sink
set_interface_property reset EXPORT_OF clk_125.clk_in_reset
add_interface memory conduit end
set_interface_property memory EXPORT_OF mem_if_lpddr2_emif.memory
add_interface oct conduit end
set_interface_property oct EXPORT_OF mem_if_lpddr2_emif.oct
add_interface mem_if_lpddr2_emif_status conduit end
set_interface_property mem_if_lpddr2_emif_status EXPORT_OF mem_if_lpddr2_emif.status
add_interface key_external_connection conduit end
set_interface_property key_external_connection EXPORT_OF key.external_connection
add_interface mem_if_lpddr2_emif_pll_sharing conduit end
set_interface_property mem_if_lpddr2_emif_pll_sharing EXPORT_OF mem_if_lpddr2_emif.pll_sharing
add_interface mem_if_lpddr2_emif_avl_0 avalon slave
set_interface_property mem_if_lpddr2_emif_avl_0 EXPORT_OF mem_if_lpddr2_emif.avl_0
add_interface mm_clock_crossing_bridge_0_m0 avalon master
set_interface_property mm_clock_crossing_bridge_0_m0 EXPORT_OF mm_clock_crossing_bridge_0.m0
add_interface uart_usb conduit end
set_interface_property uart_usb EXPORT_OF uart_usb.external_connection
add_interface led_green conduit end
set_interface_property led_green EXPORT_OF led_green.external_connection
add_interface led_red conduit end
set_interface_property led_red EXPORT_OF led_red.external_connection
add_interface sd_card conduit end
set_interface_property sd_card EXPORT_OF spi_master_0.external
add_interface tristate_conduit_bridge_sram_out conduit end
set_interface_property tristate_conduit_bridge_sram_out EXPORT_OF tristate_conduit_bridge_0.out
add_interface switches conduit end
set_interface_property switches EXPORT_OF switches.external_connection

set_interconnect_requirement {$system} qsys_mm.clockCrossingAdapter HANDSHAKE
set_interconnect_requirement {$system} qsys_mm.maxAdditionalLatency 1

save_system C5G_QSYS.qsys
